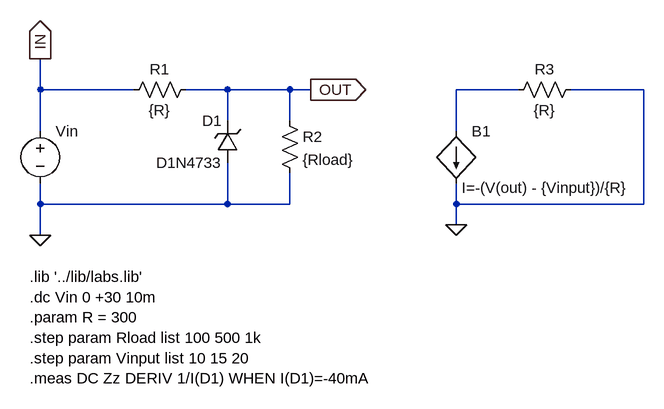
[diagram p0: schematic zener_reg.asc]
zener_reg.asc, the LTspice schematic file:
Version 4
SHEET 1 1144 804
WIRE -32 304 -32 256
WIRE 112 304 -32 304
WIRE 256 304 192 304
WIRE 352 304 256 304
WIRE 384 304 352 304
WIRE 704 304 608 304
WIRE 896 304 784 304
WIRE 256 352 256 304
WIRE 352 352 352 304
WIRE -32 368 -32 304
WIRE 608 368 608 304
WIRE -32 480 -32 448
WIRE 256 480 256 416
WIRE 256 480 -32 480
WIRE 352 480 352 432
WIRE 352 480 256 480
WIRE 608 480 608 448
WIRE 896 480 896 304
WIRE 896 480 608 480
WIRE 608 512 608 480
WIRE -32 528 -32 480
FLAG -32 528 0
FLAG 384 304 OUT
IOPIN 384 304 Out
FLAG 608 512 0
FLAG -32 256 IN
IOPIN -32 256 Out
SYMBOL zener 272 416 R180
WINDOW 0 24 64 Left 2
WINDOW 3 24 0 Left 2
SYMATTR InstName D1
SYMATTR Value D1N4733
SYMBOL res 208 288 R90
WINDOW 0 0 56 VBottom 2
WINDOW 3 32 56 VTop 2
SYMATTR InstName R1
SYMATTR Value {R}
SYMBOL voltage -32 352 R0
WINDOW 123 0 0 Left 2
WINDOW 39 0 0 Left 2
SYMATTR InstName Vin
SYMATTR Value ""
SYMBOL res 800 288 R90
WINDOW 0 0 56 VBottom 2
WINDOW 3 32 56 VTop 2
SYMATTR InstName R3
SYMATTR Value {R}
SYMBOL bi 608 368 R0
WINDOW 3 8 87 Left 2
SYMATTR InstName B1
SYMATTR Value I=-(V(out) - {Vinput})/{R}
SYMBOL res 336 336 R0
SYMATTR InstName R2
SYMATTR Value {Rload}
TEXT -48 592 Left 2 !.lib '../lib/labs.lib'\n.dc Vin 0 +30 10m\n.param R = 300\n.step param Rload list 100 500 1k\n.step param Vinput list 10 15 20\n.meas DC Zz DERIV 1/I(D1) WHEN I(D1)=-40mA

The netlist it stands for:
* zener_reg.asc
D1 0 OUT D1N4733
R1 OUT IN {R}
Vin IN 0
R3 0 N001 {R}
B1 N001 0 I=-(V(out) - {Vinput})/{R}
R2 OUT 0 {Rload}
.model D D
.lib standard.dio
.lib '../lib/labs.lib'
.dc Vin 0 +30 10m
.param R = 300
.step param Rload list 100 500 1k
.step param Vinput list 10 15 20
.meas DC Zz DERIV 1/I(D1) WHEN I(D1)=-40mA
.backanno
.end